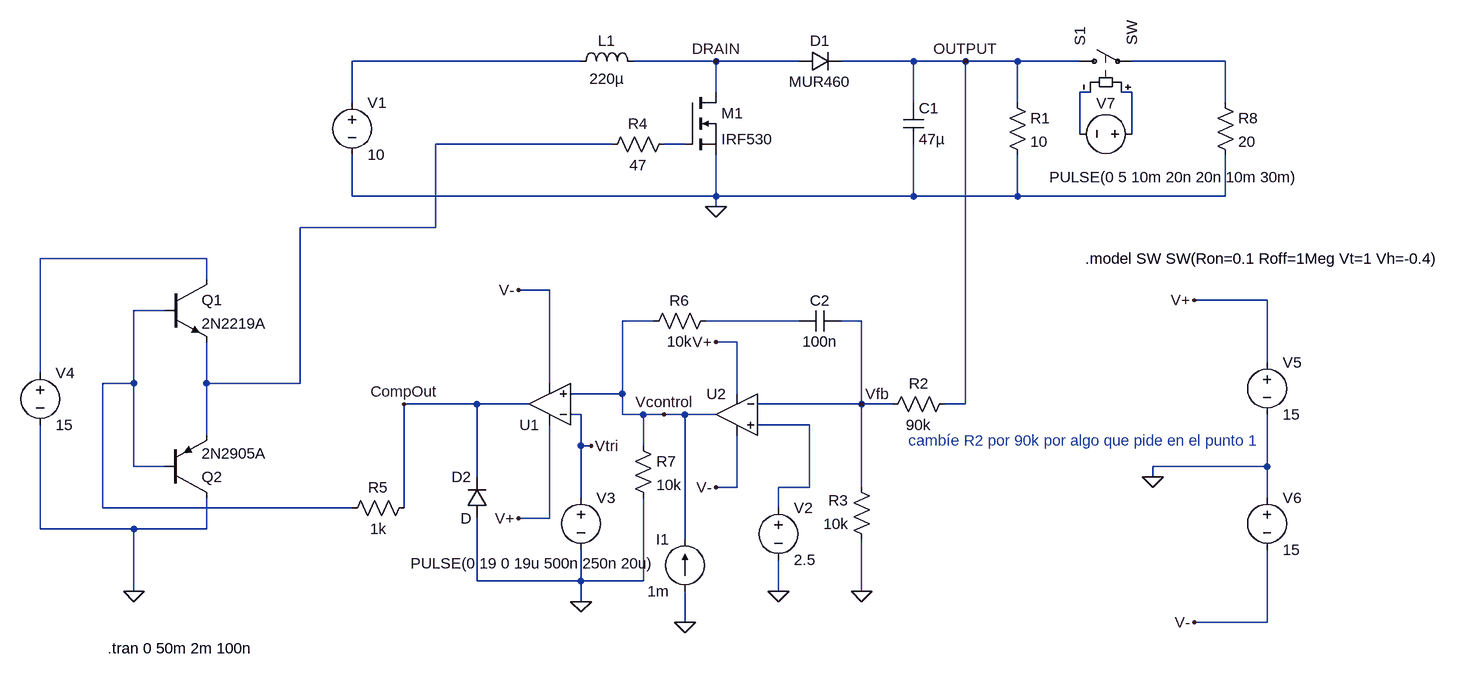
[diagram p0: schematic sim.asc]
sim.asc, the LTspice schematic file:
Version 4
SHEET 1 2012 680
WIRE 688 -368 336 -368
WIRE 896 -368 768 -368
WIRE 1024 -368 896 -368
WIRE 1200 -368 1088 -368
WIRE 1280 -368 1200 -368
WIRE 1360 -368 1280 -368
WIRE 1456 -368 1360 -368
WIRE 1680 -368 1536 -368
WIRE 896 -320 896 -368
WIRE 1472 -320 1456 -320
WIRE 1536 -320 1520 -320
WIRE 336 -304 336 -368
WIRE 1200 -304 1200 -368
WIRE 1360 -304 1360 -368
WIRE 1680 -304 1680 -368
WIRE 1456 -256 1456 -320
WIRE 1536 -256 1536 -320
WIRE 736 -240 464 -240
WIRE 848 -240 816 -240
WIRE 336 -160 336 -224
WIRE 896 -160 896 -224
WIRE 896 -160 336 -160
WIRE 1200 -160 1200 -240
WIRE 1200 -160 896 -160
WIRE 1360 -160 1360 -224
WIRE 1360 -160 1200 -160
WIRE 1680 -160 1680 -224
WIRE 1680 -160 1360 -160
WIRE 896 -144 896 -160
WIRE 464 -112 464 -240
WIRE 464 -112 256 -112
WIRE 112 -64 -144 -64
WIRE 112 -32 112 -64
WIRE 640 -16 592 -16
WIRE 1744 0 1632 0
WIRE 48 16 0 16
WIRE 800 32 752 32
WIRE 1024 32 880 32
WIRE 1120 32 1088 32
WIRE 928 64 896 64
WIRE 1744 96 1744 0
WIRE -144 112 -144 -64
WIRE 0 128 0 16
WIRE 0 128 -48 128
WIRE 112 128 112 64
WIRE 256 128 256 -112
WIRE 256 128 112 128
WIRE 640 128 640 -16
WIRE 752 144 752 32
WIRE 752 144 672 144
WIRE 928 144 928 64
WIRE 528 160 416 160
WIRE 608 160 528 160
WIRE 1120 160 1120 32
WIRE 1120 160 960 160
WIRE 1168 160 1120 160
WIRE 1280 160 1280 -368
WIRE 1280 160 1248 160
WIRE 688 176 672 176
WIRE 752 176 752 144
WIRE 784 176 752 176
WIRE 816 176 784 176
WIRE 848 176 816 176
WIRE 896 176 848 176
WIRE 1040 192 960 192
WIRE 112 208 112 128
WIRE 688 224 688 176
WIRE 704 224 688 224
WIRE 784 224 784 176
WIRE 0 256 0 128
WIRE 48 256 0 256
WIRE 1744 256 1744 176
WIRE 1744 256 1568 256
WIRE 528 272 528 160
WIRE 1568 272 1568 256
WIRE 928 288 928 208
WIRE 928 288 896 288
WIRE 1040 288 1040 192
WIRE 1040 288 992 288
WIRE 1120 288 1120 160
WIRE 688 304 688 224
WIRE 1744 304 1744 256
WIRE -48 320 -48 128
WIRE 336 320 -48 320
WIRE 416 320 416 160
WIRE 992 320 992 288
WIRE 640 336 640 192
WIRE 640 336 592 336
WIRE -144 352 -144 192
WIRE 0 352 -144 352
WIRE 112 352 112 304
WIRE 112 352 0 352
WIRE 848 368 848 176
WIRE 528 432 528 336
WIRE 688 432 688 384
WIRE 688 432 528 432
WIRE 784 432 784 304
WIRE 784 432 688 432
WIRE 0 448 0 352
WIRE 992 448 992 400
WIRE 1120 448 1120 368
WIRE 688 464 688 432
WIRE 848 496 848 448
WIRE 1744 496 1744 384
WIRE 1744 496 1632 496
FLAG 0 448 0
FLAG 688 464 0
FLAG 992 448 0
FLAG 848 496 0
FLAG 1120 448 0
FLAG 896 -144 0
FLAG 1568 272 0
FLAG 1632 0 V+
FLAG 1632 496 V-
FLAG 896 64 V+
FLAG 592 336 V+
FLAG 896 288 V-
FLAG 592 -16 V-
FLAG 1120 160 Vfb
FLAG 816 176 Vcontrol
FLAG 416 160 CompOut
FLAG 1280 -368 OUTPUT
FLAG 896 -368 DRAIN
FLAG 704 224 Vtri
SYMBOL voltage -144 96 R0
WINDOW 123 0 0 Left 0
WINDOW 39 0 0 Left 0
SYMATTR InstName V4
SYMATTR Value 15
SYMBOL npn 48 -32 R0
SYMATTR InstName Q1
SYMATTR Value 2N2219A
SYMBOL pnp 48 304 M180
SYMATTR InstName Q2
SYMATTR Value 2N2905A
SYMBOL res 432 304 R90
WINDOW 0 0 56 VBottom 2
WINDOW 3 32 56 VTop 2
SYMATTR InstName R5
SYMATTR Value 1k
SYMBOL diode 544 336 R180
WINDOW 0 24 64 Left 2
WINDOW 3 24 0 Left 2
SYMATTR InstName D2
SYMBOL Opamps\\UniversalOpamp2 640 160 R180
SYMATTR InstName U1
SYMBOL voltage 688 288 R0
WINDOW 3 -262 117 Left 2
WINDOW 123 0 0 Left 0
WINDOW 39 0 0 Left 0
SYMATTR Value PULSE(0 19 0 19u 500n 250n 20u)
SYMATTR InstName V3
SYMBOL res 896 16 R90
WINDOW 0 0 56 VBottom 2
WINDOW 3 32 56 VTop 2
SYMATTR InstName R6
SYMATTR Value 10k
SYMBOL cap 1088 16 R90
WINDOW 0 0 32 VBottom 2
WINDOW 3 32 32 VTop 2
SYMATTR InstName C2
SYMATTR Value 100n
SYMBOL Opamps\\UniversalOpamp2 928 176 M0
SYMATTR InstName U2
SYMBOL voltage 992 304 R0
WINDOW 123 0 0 Left 0
WINDOW 39 0 0 Left 0
SYMATTR InstName V2
SYMATTR Value 2.5
SYMBOL res 768 208 R0
SYMATTR InstName R7
SYMATTR Value 10k
SYMBOL current 848 448 R180
WINDOW 0 24 80 Left 2
WINDOW 3 24 0 Left 2
WINDOW 123 0 0 Left 0
WINDOW 39 0 0 Left 0
SYMATTR InstName I1
SYMATTR Value 1m
SYMBOL res 1344 -320 R0
SYMATTR InstName R1
SYMATTR Value 10
SYMBOL res 1264 144 R90
WINDOW 0 0 56 VBottom 2
WINDOW 3 32 56 VTop 2
SYMATTR InstName R2
SYMATTR Value 90k
SYMBOL res 1136 384 R180
WINDOW 0 36 76 Left 2
WINDOW 3 36 40 Left 2
SYMATTR InstName R3
SYMATTR Value 10k
SYMBOL cap 1184 -304 R0
SYMATTR InstName C1
SYMATTR Value 47µ
SYMBOL sw 1440 -368 R270
SYMATTR InstName S1
SYMBOL voltage 1552 -256 R90
WINDOW 0 -32 56 VBottom 2
WINDOW 3 51 -49 VTop 2
WINDOW 123 0 0 Left 0
WINDOW 39 0 0 Left 0
SYMATTR InstName V7
SYMATTR Value PULSE(0 5 10m 20n 20n 10m 30m)
SYMBOL res 1664 -320 R0
SYMATTR InstName R8
SYMATTR Value 20
SYMBOL diode 1024 -352 R270
WINDOW 0 32 32 VTop 2
WINDOW 3 0 32 VBottom 2
SYMATTR InstName D1
SYMATTR Value MUR460
SYMBOL ind 672 -352 R270
WINDOW 0 32 56 VTop 2
WINDOW 3 5 56 VBottom 2
SYMATTR InstName L1
SYMATTR Value 220µ
SYMBOL voltage 336 -320 R0
WINDOW 123 0 0 Left 0
WINDOW 39 0 0 Left 0
SYMATTR InstName V1
SYMATTR Value 10
SYMBOL res 832 -256 R90
WINDOW 0 0 56 VBottom 2
WINDOW 3 32 56 VTop 2
SYMATTR InstName R4
SYMATTR Value 47
SYMBOL nmos 848 -320 R0
SYMATTR InstName M1
SYMATTR Value IRF530
SYMBOL voltage 1744 80 R0
WINDOW 123 0 0 Left 0
WINDOW 39 0 0 Left 0
SYMATTR InstName V5
SYMATTR Value 15
SYMBOL voltage 1744 288 R0
WINDOW 123 0 0 Left 0
WINDOW 39 0 0 Left 0
SYMATTR InstName V6
SYMATTR Value 15
TEXT 1464 -64 Left 2 !.model SW SW(Ron=0.1 Roff=1Meg Vt=1 Vh=-0.4)
TEXT -40 536 Left 2 !.tran 0 50m 2m 100n
TEXT 1192 216 Left 2 ;cambíe R2 por 90k por algo que pide en el punto 1

The netlist it stands for:
* sim.asc
V4 N007 0 15
Q1 N007 N008 N005 0 2N2219A
Q2 0 N008 N005 0 2N2905A
R5 CompOut N008 1k
D2 0 CompOut D
XU1 Vcontrol Vtri V+ V- CompOut level.2 Avol=1Meg GBW=10Meg Slew=10Meg ilimit=25m rail=0 Vos=0 phimargin=45 en=0 enk=0 in=0 ink=0 Rin=500Meg  ; pins IN+ IN- V+ V- OUT
V3 Vtri 0 PULSE(0 19 0 19u 500n 250n 20u)
R6 N009 Vcontrol 10k
C2 Vfb N009 100n
XU2 N010 Vfb V+ V- Vcontrol level.2 Avol=1Meg GBW=10Meg Slew=10Meg ilimit=25m rail=0 Vos=0 phimargin=45 en=0 enk=0 in=0 ink=0 Rin=500Meg  ; pins IN+ IN- V+ V- OUT
V2 N010 0 2.5
R7 Vcontrol 0 10k
I1 0 Vcontrol 1m
R1 OUTPUT 0 10
R2 OUTPUT Vfb 90k
R3 0 Vfb 10k
C1 OUTPUT 0 47µ
S1 OUTPUT N002 N004 N003 SW
V7 N004 N003 PULSE(0 5 10m 20n 20n 10m 30m)
R8 N002 0 20
D1 DRAIN OUTPUT MUR460
L1 N001 DRAIN 220µ
V1 N001 0 10
R4 N006 N005 47
M1 DRAIN N006 0 0 IRF530
V5 V+ 0 15
V6 0 V- 15
.model D D
.lib standard.dio
.model NPN NPN
.model PNP PNP
.lib standard.bjt
.model NMOS NMOS
.model PMOS PMOS
.lib standard.mos
.model SW SW(Ron=0.1 Roff=1Meg Vt=1 Vh=-0.4)
.tran 0 50m 2m 100n
* cambíe R2 por 90k por algo que pide en el punto 1
.lib UniversalOpamps2.sub
.backanno
.end